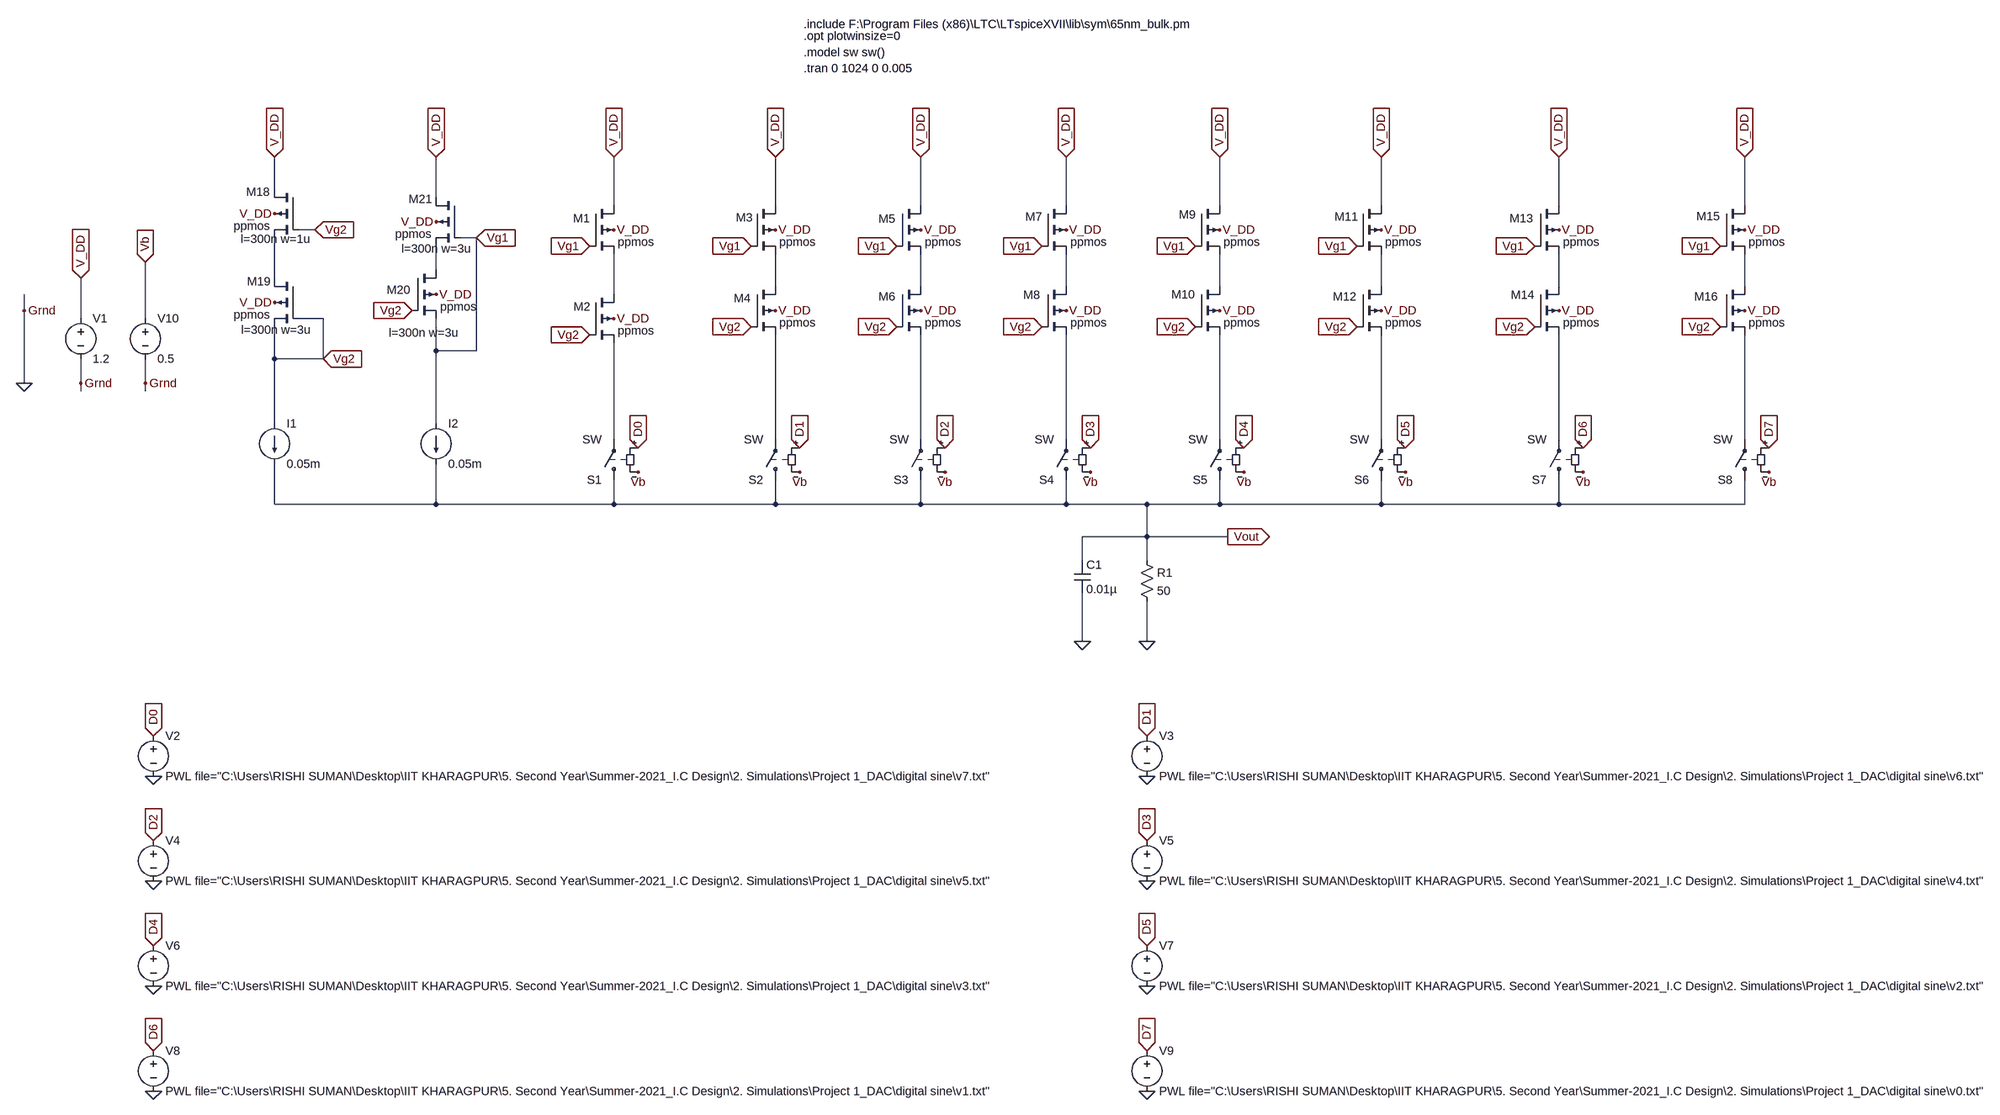
[diagram p0: schematic Digital Sine to DAC.asc]
Digital Sine to DAC.asc, the LTspice schematic file:
Version 4
SHEET 1 4044 1556
WIRE -1168 -352 -1168 -416
WIRE -848 -336 -848 -416
WIRE -496 -320 -496 -416
WIRE -176 -320 -176 -416
WIRE 112 -320 112 -416
WIRE 400 -320 400 -416
WIRE 704 -320 704 -416
WIRE 1024 -320 1024 -416
WIRE 1376 -320 1376 -416
WIRE 1744 -320 1744 -416
WIRE -1088 -272 -1120 -272
WIRE -768 -256 -800 -256
WIRE -848 -192 -848 -240
WIRE -1168 -176 -1168 -256
WIRE -176 -160 -176 -224
WIRE 112 -160 112 -224
WIRE 400 -160 400 -224
WIRE 704 -160 704 -224
WIRE 1024 -160 1024 -224
WIRE 1376 -160 1376 -224
WIRE 1744 -160 1744 -224
WIRE -496 -144 -496 -224
WIRE -1664 -112 -1664 -144
WIRE -1552 -96 -1552 -176
WIRE -1424 -96 -1424 -208
WIRE -1072 -96 -1120 -96
WIRE -848 -32 -848 -96
WIRE -768 -32 -768 -256
WIRE -768 -32 -848 -32
WIRE -1168 -16 -1168 -80
WIRE -1072 -16 -1072 -96
WIRE -1072 -16 -1168 -16
WIRE -1664 32 -1664 -112
WIRE -1552 32 -1552 -16
WIRE -1424 32 -1424 -16
WIRE -1552 48 -1552 32
WIRE -1424 48 -1424 32
WIRE -1168 112 -1168 -16
WIRE -848 112 -848 -32
WIRE -496 144 -496 -48
WIRE -176 144 -176 -64
WIRE 112 144 112 -64
WIRE 400 144 400 -64
WIRE 704 144 704 -64
WIRE 1024 144 1024 -64
WIRE 1376 144 1376 -64
WIRE 1744 144 1744 -64
WIRE -1168 272 -1168 192
WIRE -848 272 -848 192
WIRE -848 272 -1168 272
WIRE -496 272 -496 224
WIRE -496 272 -848 272
WIRE -176 272 -176 224
WIRE -176 272 -496 272
WIRE 112 272 112 224
WIRE 112 272 -176 272
WIRE 400 272 400 224
WIRE 400 272 112 272
WIRE 560 272 400 272
WIRE 704 272 704 224
WIRE 704 272 560 272
WIRE 1024 272 1024 224
WIRE 1024 272 704 272
WIRE 1376 272 1376 224
WIRE 1376 272 1024 272
WIRE 1744 272 1744 224
WIRE 1744 272 1376 272
WIRE 560 336 560 272
WIRE 560 336 432 336
WIRE 720 336 560 336
WIRE 432 384 432 336
WIRE 560 384 560 336
WIRE 432 544 432 448
WIRE 560 544 560 464
FLAG -1664 32 0
FLAG -1664 -112 Grnd
FLAG -1552 32 Grnd
FLAG -1552 -176 V_DD
IOPIN -1552 -176 In
FLAG -1168 -416 V_DD
IOPIN -1168 -416 In
FLAG -848 -416 V_DD
IOPIN -848 -416 In
FLAG 560 544 0
FLAG -448 208 Vb
FLAG -128 208 Vb
FLAG 160 208 Vb
FLAG 448 208 Vb
FLAG 752 208 Vb
FLAG 1072 208 Vb
FLAG 1424 208 Vb
FLAG 1792 208 Vb
FLAG -448 160 D0
IOPIN -448 160 In
FLAG -128 160 D1
IOPIN -128 160 In
FLAG 160 160 D2
IOPIN 160 160 In
FLAG 448 160 D3
IOPIN 448 160 In
FLAG 752 160 D4
IOPIN 752 160 In
FLAG 1072 160 D5
IOPIN 1072 160 In
FLAG 1424 160 D6
IOPIN 1424 160 In
FLAG 1792 160 D7
IOPIN 1792 160 In
FLAG -1408 816 0
FLAG -1408 736 D0
IOPIN -1408 736 In
FLAG 560 816 0
FLAG 560 736 D1
IOPIN 560 736 In
FLAG -1408 1024 0
FLAG -1408 944 D2
IOPIN -1408 944 In
FLAG 560 1024 0
FLAG 560 944 D3
IOPIN 560 944 In
FLAG -1408 1232 0
FLAG -1408 1152 D4
IOPIN -1408 1152 In
FLAG 560 1232 0
FLAG 560 1152 D5
IOPIN 560 1152 In
FLAG -1408 1440 0
FLAG -1408 1360 D6
IOPIN -1408 1360 In
FLAG 560 1360 D7
IOPIN 560 1360 In
FLAG -496 -416 V_DD
IOPIN -496 -416 In
FLAG -176 -416 V_DD
IOPIN -176 -416 In
FLAG 112 -416 V_DD
IOPIN 112 -416 In
FLAG 400 -416 V_DD
IOPIN 400 -416 In
FLAG 704 -416 V_DD
IOPIN 704 -416 In
FLAG 1024 -416 V_DD
IOPIN 1024 -416 In
FLAG 1376 -416 V_DD
IOPIN 1376 -416 In
FLAG 1744 -416 V_DD
IOPIN 1744 -416 In
FLAG -1424 32 Grnd
FLAG -1424 -208 Vb
IOPIN -1424 -208 In
FLAG 432 544 0
FLAG 560 1440 0
FLAG -496 -272 V_DD
FLAG -496 -96 V_DD
FLAG -176 -272 V_DD
FLAG -176 -112 V_DD
FLAG 112 -272 V_DD
FLAG 112 -112 V_DD
FLAG 400 -272 V_DD
FLAG 400 -112 V_DD
FLAG 704 -272 V_DD
FLAG 704 -112 V_DD
FLAG 1024 -272 V_DD
FLAG 1024 -112 V_DD
FLAG 1376 -272 V_DD
FLAG 1376 -112 V_DD
FLAG 1744 -272 V_DD
FLAG 1744 -112 V_DD
FLAG -544 -240 Vg1
IOPIN -544 -240 In
FLAG -224 -240 Vg1
IOPIN -224 -240 In
FLAG 64 -240 Vg1
IOPIN 64 -240 In
FLAG 352 -240 Vg1
IOPIN 352 -240 In
FLAG 656 -240 Vg1
IOPIN 656 -240 In
FLAG 976 -240 Vg1
IOPIN 976 -240 In
FLAG 1328 -240 Vg1
IOPIN 1328 -240 In
FLAG 1696 -240 Vg1
IOPIN 1696 -240 In
FLAG 1696 -80 Vg2
IOPIN 1696 -80 In
FLAG 1328 -80 Vg2
IOPIN 1328 -80 In
FLAG 976 -80 Vg2
IOPIN 976 -80 In
FLAG 656 -80 Vg2
IOPIN 656 -80 In
FLAG 352 -80 Vg2
IOPIN 352 -80 In
FLAG 64 -80 Vg2
IOPIN 64 -80 In
FLAG -224 -80 Vg2
IOPIN -224 -80 In
FLAG -544 -64 Vg2
IOPIN -544 -64 In
FLAG -1168 -304 V_DD
FLAG -1168 -128 V_DD
FLAG -848 -288 V_DD
FLAG -848 -144 V_DD
FLAG -1088 -272 Vg2
IOPIN -1088 -272 In
FLAG -1072 -16 Vg2
IOPIN -1072 -16 In
FLAG -896 -112 Vg2
IOPIN -896 -112 In
FLAG -768 -256 Vg1
IOPIN -768 -256 In
FLAG 720 336 Vout
IOPIN 720 336 Out
SYMBOL voltage -1552 -112 R0
WINDOW 123 0 0 Left 0
WINDOW 39 0 0 Left 0
SYMATTR InstName V1
SYMATTR Value 1.2
SYMBOL sw -496 240 R180
SYMATTR InstName S1
SYMBOL sw -176 240 R180
SYMATTR InstName S2
SYMBOL sw 112 240 R180
SYMATTR InstName S3
SYMBOL sw 400 240 R180
SYMATTR InstName S4
SYMBOL sw 704 240 R180
SYMATTR InstName S5
SYMBOL sw 1024 240 R180
SYMATTR InstName S6
SYMBOL sw 1376 240 R180
SYMATTR InstName S7
SYMBOL sw 1744 240 R180
SYMATTR InstName S8
SYMBOL res 544 368 R0
SYMATTR InstName R1
SYMATTR Value 50
SYMBOL voltage -1408 720 R0
WINDOW 123 0 0 Left 0
WINDOW 39 0 0 Left 0
SYMATTR InstName V2
SYMATTR Value PWL file="C:\Users\RISHI SUMAN\Desktop\IIT KHARAGPUR\5. Second Year\Summer-2021_I.C Design\2. Simulations\Project 1_DAC\digital sine\v7.txt"
SYMBOL voltage 560 720 R0
WINDOW 123 0 0 Left 0
WINDOW 39 0 0 Left 0
SYMATTR InstName V3
SYMATTR Value PWL file="C:\Users\RISHI SUMAN\Desktop\IIT KHARAGPUR\5. Second Year\Summer-2021_I.C Design\2. Simulations\Project 1_DAC\digital sine\v6.txt"
SYMBOL voltage -1408 928 R0
WINDOW 123 0 0 Left 0
WINDOW 39 0 0 Left 0
SYMATTR InstName V4
SYMATTR Value PWL file="C:\Users\RISHI SUMAN\Desktop\IIT KHARAGPUR\5. Second Year\Summer-2021_I.C Design\2. Simulations\Project 1_DAC\digital sine\v5.txt"
SYMBOL voltage 560 928 R0
WINDOW 123 0 0 Left 0
WINDOW 39 0 0 Left 0
SYMATTR InstName V5
SYMATTR Value PWL file="C:\Users\RISHI SUMAN\Desktop\IIT KHARAGPUR\5. Second Year\Summer-2021_I.C Design\2. Simulations\Project 1_DAC\digital sine\v4.txt"
SYMBOL voltage -1408 1136 R0
WINDOW 123 0 0 Left 0
WINDOW 39 0 0 Left 0
SYMATTR InstName V6
SYMATTR Value PWL file="C:\Users\RISHI SUMAN\Desktop\IIT KHARAGPUR\5. Second Year\Summer-2021_I.C Design\2. Simulations\Project 1_DAC\digital sine\v3.txt"
SYMBOL voltage 560 1136 R0
WINDOW 123 0 0 Left 0
WINDOW 39 0 0 Left 0
SYMATTR InstName V7
SYMATTR Value PWL file="C:\Users\RISHI SUMAN\Desktop\IIT KHARAGPUR\5. Second Year\Summer-2021_I.C Design\2. Simulations\Project 1_DAC\digital sine\v2.txt"
SYMBOL voltage -1408 1344 R0
WINDOW 123 0 0 Left 0
WINDOW 39 0 0 Left 0
SYMATTR InstName V8
SYMATTR Value PWL file="C:\Users\RISHI SUMAN\Desktop\IIT KHARAGPUR\5. Second Year\Summer-2021_I.C Design\2. Simulations\Project 1_DAC\digital sine\v1.txt"
SYMBOL voltage 560 1344 R0
WINDOW 123 0 0 Left 0
WINDOW 39 0 0 Left 0
SYMATTR InstName V9
SYMATTR Value PWL file="C:\Users\RISHI SUMAN\Desktop\IIT KHARAGPUR\5. Second Year\Summer-2021_I.C Design\2. Simulations\Project 1_DAC\digital sine\v0.txt"
SYMBOL pmos4 -896 -192 R0
WINDOW 0 -50 39 Left 2
WINDOW 123 -46 124 Left 2
SYMATTR InstName M20
SYMATTR Value2 l=300n w=3u
SYMATTR Value ppmos
SYMBOL current -1168 112 R0
WINDOW 123 0 0 Left 0
WINDOW 39 0 0 Left 0
SYMATTR InstName I1
SYMATTR Value 0.05m
SYMBOL current -848 112 R0
WINDOW 123 0 0 Left 0
WINDOW 39 0 0 Left 0
SYMATTR InstName I2
SYMATTR Value 0.05m
SYMBOL voltage -1424 -112 R0
WINDOW 123 0 0 Left 0
WINDOW 39 0 0 Left 0
SYMATTR InstName V10
SYMATTR Value 0.5
SYMBOL cap 416 384 R0
SYMATTR InstName C1
SYMATTR Value 0.01µ
SYMBOL pmos4 -544 -320 R0
WINDOW 0 -33 25 Left 2
SYMATTR InstName M1
SYMATTR Value ppmos
SYMATTR Value2 l=300n w=3u
SYMBOL pmos4 -544 -144 R0
WINDOW 0 -32 24 Left 2
SYMATTR InstName M2
SYMATTR Value ppmos
SYMATTR Value2 l=300n w=3u
SYMBOL pmos4 -224 -320 R0
WINDOW 0 -30 24 Left 2
SYMATTR InstName M3
SYMATTR Value ppmos
SYMATTR Value2 l=300n w=3u m=2
SYMBOL pmos4 -224 -160 R0
WINDOW 0 -34 24 Left 2
SYMATTR InstName M4
SYMATTR Value ppmos
SYMATTR Value2 l=300n w=3u m=2
SYMBOL pmos4 64 -320 R0
WINDOW 0 -36 26 Left 2
SYMATTR InstName M5
SYMATTR Value ppmos
SYMATTR Value2 l=300n w=3u m=4
SYMBOL pmos4 64 -160 R0
WINDOW 0 -36 20 Left 2
SYMATTR InstName M6
SYMATTR Value ppmos
SYMATTR Value2 l=300n w=3u m=4
SYMBOL pmos4 352 -320 R0
WINDOW 0 -33 22 Left 2
SYMATTR InstName M7
SYMATTR Value ppmos
SYMATTR Value2 l=300n w=3u m=8
SYMBOL pmos4 352 -160 R0
WINDOW 0 -37 17 Left 2
SYMATTR InstName M8
SYMATTR Value ppmos
SYMATTR Value2 l=300n w=3u m=8
SYMBOL pmos4 656 -320 R0
WINDOW 0 -33 18 Left 2
SYMATTR InstName M9
SYMATTR Value ppmos
SYMATTR Value2 l=300n w=3u m=16
SYMBOL pmos4 656 -160 R0
WINDOW 0 -48 16 Left 2
SYMATTR InstName M10
SYMATTR Value ppmos
SYMATTR Value2 l=300n w=3u m=16
SYMBOL pmos4 976 -320 R0
WINDOW 0 -44 22 Left 2
SYMATTR InstName M11
SYMATTR Value ppmos
SYMATTR Value2 l=300n w=3u m=32
SYMBOL pmos4 976 -160 R0
WINDOW 0 -48 20 Left 2
SYMATTR InstName M12
SYMATTR Value ppmos
SYMATTR Value2 l=300n w=3u m=32
SYMBOL pmos4 1328 -320 R0
WINDOW 0 -50 25 Left 2
SYMATTR InstName M13
SYMATTR Value ppmos
SYMATTR Value2 l=300n w=3u m=64
SYMBOL pmos4 1328 -160 R0
WINDOW 0 -47 17 Left 2
SYMATTR InstName M14
SYMATTR Value ppmos
SYMATTR Value2 l=300n w=3u m=64
SYMBOL pmos4 1696 -320 R0
WINDOW 0 -48 21 Left 2
SYMATTR InstName M15
SYMATTR Value ppmos
SYMATTR Value2 l=300n w=3u m=128
SYMBOL pmos4 1696 -160 R0
WINDOW 0 -52 20 Left 2
SYMATTR InstName M16
SYMATTR Value ppmos
SYMATTR Value2 l=300n w=3u m=128
SYMBOL pmos4 -1120 -352 M0
WINDOW 0 57 5 Left 2
WINDOW 123 -24 98 Left 2
SYMATTR InstName M18
SYMATTR Value2 l=300n w=1u
SYMATTR Value ppmos
SYMBOL pmos4 -1120 -176 M0
WINDOW 0 55 6 Left 2
WINDOW 123 -25 102 Left 2
SYMATTR InstName M19
SYMATTR Value2 l=300n w=3u
SYMATTR Value ppmos
SYMBOL pmos4 -800 -336 M0
WINDOW 0 55 3 Left 2
WINDOW 123 -22 101 Left 2
SYMATTR InstName M21
SYMATTR Value2 l=300n w=3u
SYMATTR Value ppmos
TEXT -120 -656 Left 2 !.opt plotwinsize=0
TEXT -120 -624 Left 2 !.model sw sw()
TEXT -120 -592 Left 2 !.tran 0 1024 0 0.005
TEXT -120 -680 Left 2 !.include F:\\Program Files (x86)\\LTC\\LTspiceXVII\\lib\\sym\\65nm_bulk.pm

The netlist it stands for:
* Digital Sine to DAC.asc
V1 V_DD 0 1.2
S1 Vout N011 D0 Vb SW
S2 Vout N012 D1 Vb SW
S3 Vout N013 D2 Vb SW
S4 Vout N014 D3 Vb SW
S5 Vout N015 D4 Vb SW
S6 Vout N016 D5 Vb SW
S7 Vout N017 D6 Vb SW
S8 Vout N018 D7 Vb SW
R1 Vout 0 50
V2 D0 0 PWL file="C:\Users\RISHI SUMAN\Desktop\IIT KHARAGPUR\5. Second Year\Summer-2021_I.C Design\2. Simulations\Project 1_DAC\digital sine\v7.txt"
V3 D1 0 PWL file="C:\Users\RISHI SUMAN\Desktop\IIT KHARAGPUR\5. Second Year\Summer-2021_I.C Design\2. Simulations\Project 1_DAC\digital sine\v6.txt"
V4 D2 0 PWL file="C:\Users\RISHI SUMAN\Desktop\IIT KHARAGPUR\5. Second Year\Summer-2021_I.C Design\2. Simulations\Project 1_DAC\digital sine\v5.txt"
V5 D3 0 PWL file="C:\Users\RISHI SUMAN\Desktop\IIT KHARAGPUR\5. Second Year\Summer-2021_I.C Design\2. Simulations\Project 1_DAC\digital sine\v4.txt"
V6 D4 0 PWL file="C:\Users\RISHI SUMAN\Desktop\IIT KHARAGPUR\5. Second Year\Summer-2021_I.C Design\2. Simulations\Project 1_DAC\digital sine\v3.txt"
V7 D5 0 PWL file="C:\Users\RISHI SUMAN\Desktop\IIT KHARAGPUR\5. Second Year\Summer-2021_I.C Design\2. Simulations\Project 1_DAC\digital sine\v2.txt"
V8 D6 0 PWL file="C:\Users\RISHI SUMAN\Desktop\IIT KHARAGPUR\5. Second Year\Summer-2021_I.C Design\2. Simulations\Project 1_DAC\digital sine\v1.txt"
V9 D7 0 PWL file="C:\Users\RISHI SUMAN\Desktop\IIT KHARAGPUR\5. Second Year\Summer-2021_I.C Design\2. Simulations\Project 1_DAC\digital sine\v0.txt"
M20 N001 Vg2 Vg1 V_DD ppmos l=300n w=3u
I1 Vg2 Vout 0.05m
I2 Vg1 Vout 0.05m
V10 Vb 0 0.5
C1 Vout 0 0.01µ
M1 V_DD Vg1 N010 V_DD ppmos l=300n w=3u
M2 N010 Vg2 N011 V_DD ppmos l=300n w=3u
M3 V_DD Vg1 N003 V_DD ppmos l=300n w=3u m=2
M4 N003 Vg2 N012 V_DD ppmos l=300n w=3u m=2
M5 V_DD Vg1 N004 V_DD ppmos l=300n w=3u m=4
M6 N004 Vg2 N013 V_DD ppmos l=300n w=3u m=4
M7 V_DD Vg1 N005 V_DD ppmos l=300n w=3u m=8
M8 N005 Vg2 N014 V_DD ppmos l=300n w=3u m=8
M9 V_DD Vg1 N006 V_DD ppmos l=300n w=3u m=16
M10 N006 Vg2 N015 V_DD ppmos l=300n w=3u m=16
M11 V_DD Vg1 N007 V_DD ppmos l=300n w=3u m=32
M12 N007 Vg2 N016 V_DD ppmos l=300n w=3u m=32
M13 V_DD Vg1 N008 V_DD ppmos l=300n w=3u m=64
M14 N008 Vg2 N017 V_DD ppmos l=300n w=3u m=64
M15 V_DD Vg1 N009 V_DD ppmos l=300n w=3u m=128
M16 N009 Vg2 N018 V_DD ppmos l=300n w=3u m=128
M18 V_DD Vg2 N002 V_DD ppmos l=300n w=1u
M19 N002 Vg2 Vg2 V_DD ppmos l=300n w=3u
M21 V_DD Vg1 N001 V_DD ppmos l=300n w=3u
.model NMOS NMOS
.model PMOS PMOS
.lib standard.mos
.opt plotwinsize=0
.model sw sw()
.tran 0 1024 0 0.005
.include F:\Program Files (x86)\LTC\LTspiceXVII\lib\sym\65nm_bulk.pm
.backanno
.end